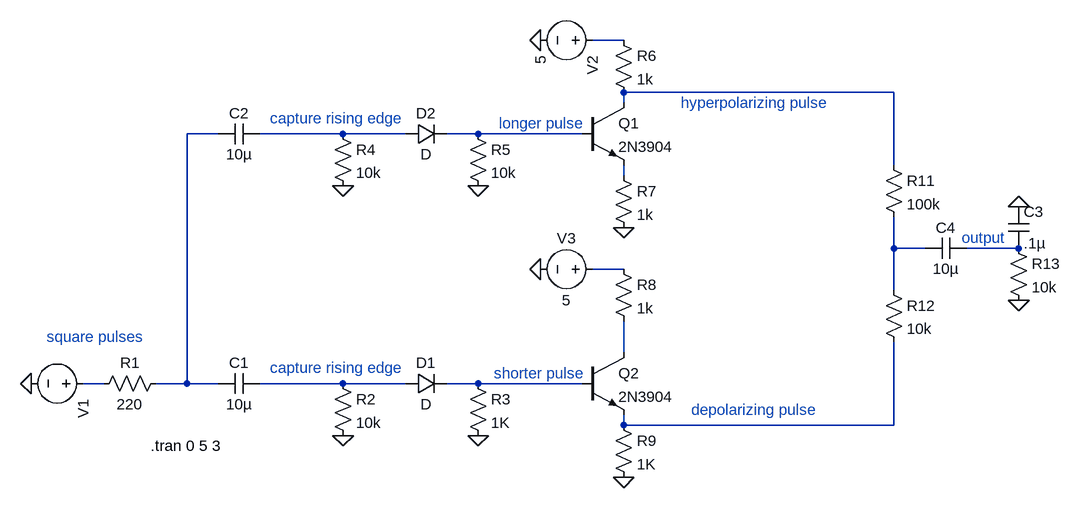
[diagram p0: schematic circuit.asc]
circuit.asc, the LTspice schematic file:
Version 4
SHEET 1 1492 680
WIRE 768 -544 720 -544
WIRE 1184 -464 768 -464
WIRE 768 -448 768 -464
WIRE 144 -400 96 -400
WIRE 336 -400 208 -400
WIRE 432 -400 336 -400
WIRE 544 -400 496 -400
WIRE 704 -400 544 -400
WIRE 1184 -352 1184 -464
WIRE 768 -336 768 -352
WIRE 1184 -224 1184 -272
WIRE 1232 -224 1184 -224
WIRE 1376 -224 1296 -224
WIRE 768 -192 720 -192
WIRE 1184 -160 1184 -224
WIRE 768 -64 768 -112
WIRE -32 -16 -64 -16
WIRE 96 -16 96 -400
WIRE 96 -16 48 -16
WIRE 144 -16 96 -16
WIRE 336 -16 208 -16
WIRE 432 -16 336 -16
WIRE 544 -16 496 -16
WIRE 704 -16 544 -16
WIRE 768 48 768 32
WIRE 1184 48 1184 -80
WIRE 1184 48 768 48
FLAG -144 -16 0
FLAG 336 64 0
FLAG 544 64 0
FLAG 336 -320 0
FLAG 768 -256 0
FLAG 544 -320 0
FLAG 768 128 0
FLAG 1376 -144 0
FLAG 1376 -288 0
FLAG 640 -544 0
FLAG 640 -192 0
SYMBOL voltage -48 -16 R90
WINDOW 3 24 96 Invisible 2
WINDOW 39 0 0 Left 2
WINDOW 123 0 0 Left 2
SYMATTR Value PULSE(0 5 0 .0001 .0001 .05 .1)
SYMATTR InstName V1
SYMBOL res -48 0 R270
WINDOW 0 32 56 VTop 2
WINDOW 3 0 56 VBottom 2
SYMATTR InstName R1
SYMATTR Value 220
SYMBOL voltage 736 -544 R90
WINDOW 123 0 0 Left 2
WINDOW 39 0 0 Left 2
SYMATTR InstName V2
SYMATTR Value 5
SYMBOL cap 208 -32 R90
WINDOW 0 0 32 VBottom 2
WINDOW 3 32 32 VTop 2
SYMATTR InstName C1
SYMATTR Value 10µ
SYMBOL res 320 -32 R0
SYMATTR InstName R2
SYMATTR Value 10k
SYMBOL res 528 -32 R0
SYMATTR InstName R3
SYMATTR Value 1K
SYMBOL diode 432 0 R270
WINDOW 0 32 32 VTop 2
WINDOW 3 0 32 VBottom 2
SYMATTR InstName D1
SYMBOL cap 208 -416 R90
WINDOW 0 0 32 VBottom 2
WINDOW 3 32 32 VTop 2
SYMATTR InstName C2
SYMATTR Value 10µ
SYMBOL res 320 -416 R0
SYMATTR InstName R4
SYMATTR Value 10k
SYMBOL diode 432 -384 R270
WINDOW 0 32 32 VTop 2
WINDOW 3 0 32 VBottom 2
SYMATTR InstName D2
SYMBOL npn 704 -448 R0
SYMATTR InstName Q1
SYMATTR Value 2N3904
SYMBOL res 752 -560 R0
SYMATTR InstName R6
SYMATTR Value 1k
SYMBOL res 752 -352 R0
SYMATTR InstName R7
SYMATTR Value 1k
SYMBOL res 528 -416 R0
SYMATTR InstName R5
SYMATTR Value 10k
SYMBOL npn 704 -64 R0
SYMATTR InstName Q2
SYMATTR Value 2N3904
SYMBOL res 752 32 R0
SYMATTR InstName R9
SYMATTR Value 1K
SYMBOL res 1168 -368 R0
SYMATTR InstName R11
SYMATTR Value 100k
SYMBOL res 1168 -176 R0
SYMATTR InstName R12
SYMATTR Value 10k
SYMBOL cap 1296 -240 R90
WINDOW 0 0 32 VBottom 2
WINDOW 3 32 32 VTop 2
SYMATTR InstName C4
SYMATTR Value 10µ
SYMBOL res 1360 -240 R0
SYMATTR InstName R13
SYMATTR Value 10k
SYMBOL res 752 -208 R0
SYMATTR InstName R8
SYMATTR Value 1k
SYMBOL cap 1360 -288 R0
SYMATTR InstName C3
SYMATTR Value .1µ
SYMBOL voltage 736 -192 R90
WINDOW 0 -32 56 VBottom 2
WINDOW 3 32 56 VTop 2
WINDOW 123 0 0 Left 2
WINDOW 39 0 0 Left 2
SYMATTR InstName V3
SYMATTR Value 5
TEXT 40 80 Left 2 !.tran 0 5 3
TEXT 568 -32 Left 2 ;shorter pulse
TEXT 576 -416 Left 2 ;longer pulse
TEXT 872 24 Left 2 ;depolarizing pulse
TEXT 856 -448 Left 2 ;hyperpolarizing pulse
TEXT 1288 -240 Left 2 ;output
TEXT -120 -88 Left 2 ;square pulses
TEXT 224 -40 Left 2 ;capture rising edge
TEXT 224 -424 Left 2 ;capture rising edge

The netlist it stands for:
* circuit.asc
V1 N011 0 PULSE(0 5 0 .0001 .0001 .05 .1)
R1 N011 N003 220
V2 N001 0 5
C1 N012 N003 10µ
R2 N012 0 10k
R3 N013 0 1K
D1 N012 N013 D
C2 N004 N003 10µ
R4 N004 0 10k
D2 N004 N005 D
Q1 N002 N005 N006 0 2N3904
R6 N001 N002 1k
R7 N006 0 1k
R5 N005 0 10k
Q2 N010 N013 N014 0 2N3904
R9 N014 0 1K
R11 N002 N007 100k
R12 N007 N014 10k
C4 N008 N007 10µ
R13 N008 0 10k
R8 N009 N010 1k
C3 0 N008 .1µ
V3 N009 0 5
.model D D
.lib standard.dio
.model NPN NPN
.model PNP PNP
.lib standard.bjt
.tran 0 5 3
* shorter pulse
* longer pulse
* depolarizing pulse
* hyperpolarizing pulse
* output
* square pulses
* capture rising edge
* capture rising edge
.backanno
.end